# EasyEDA Pro project ProProject_Strain Gauge Paddle_2023-12-18.epro, schematic Strain Gauge Paddle

## Sheets
1 ESP and Power: Create Date: 2023-10-30; Page Name: ESP and Power; Project Name: Strain Gauge Paddle; Schematic Name: Strain Gauge Paddle; Update Date: 2023-11-11; Company: EasyEDA.com; Drawed: EasyEDA Pro; Page Size: A4; Part Number: JLCPCB-002; Reviewed: EasyEDA Pro; Version: V0.1
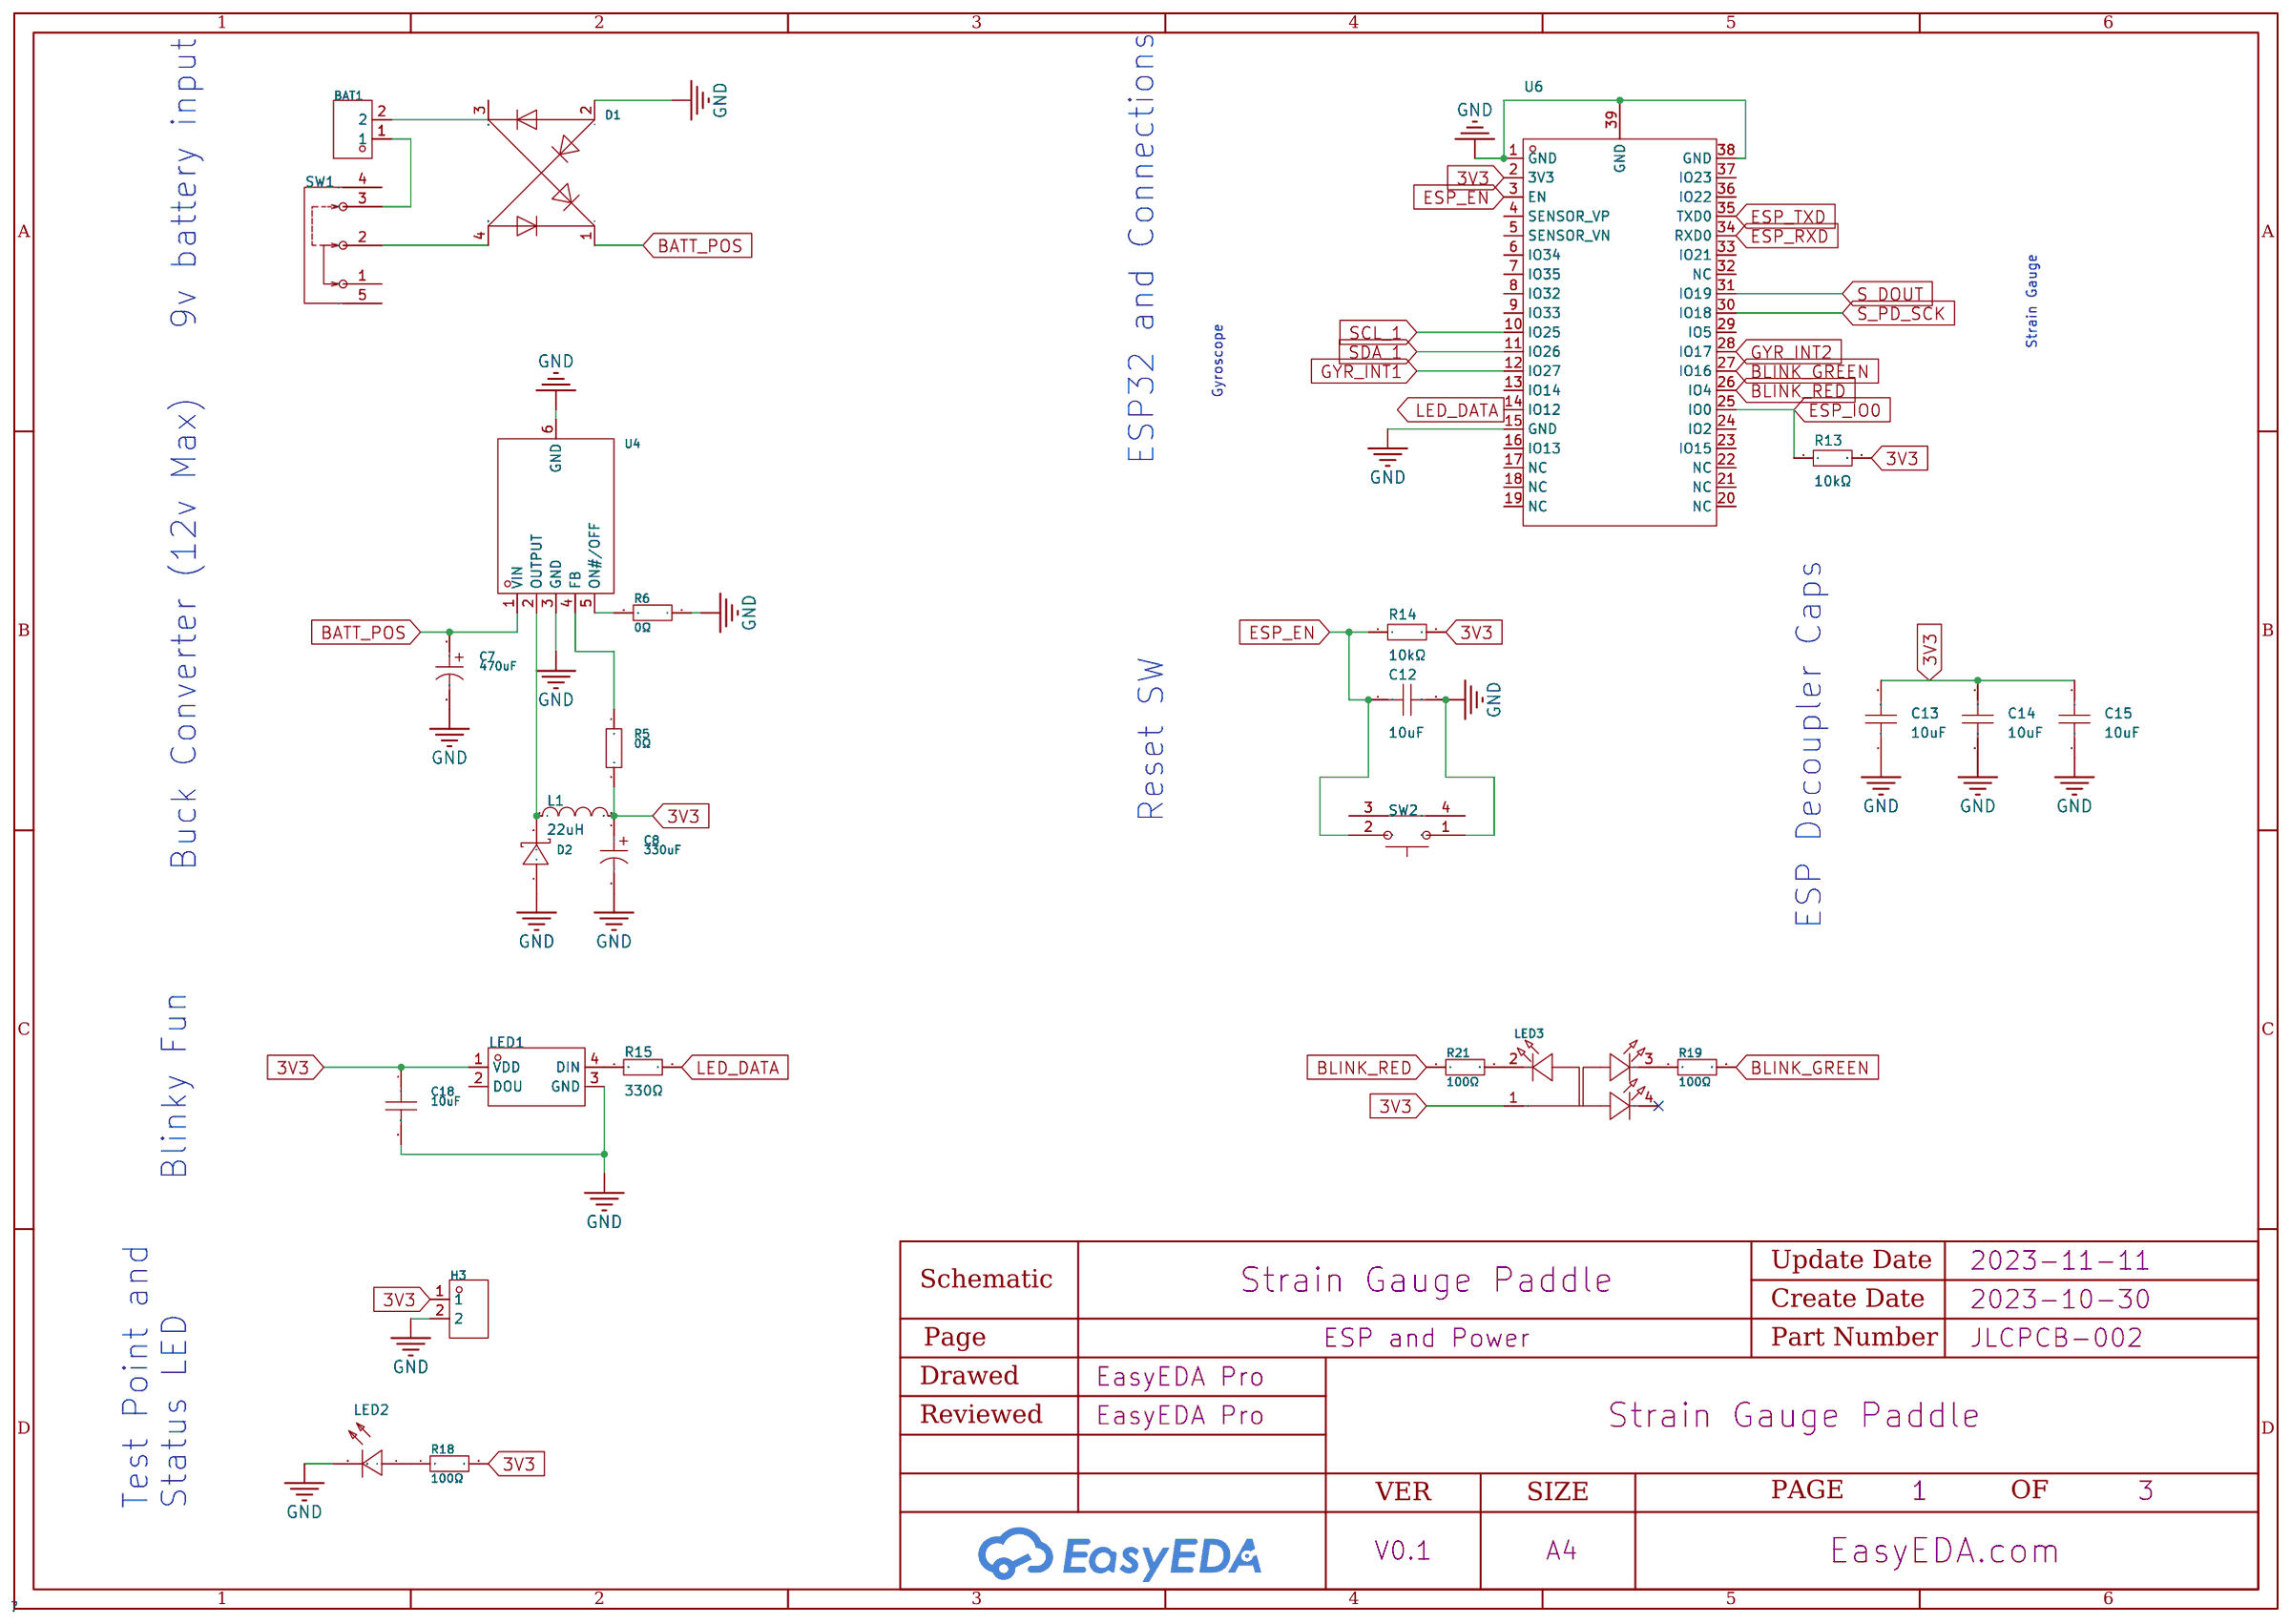
[diagram p0: ESP and Power]
2 Gyroscope and Strain Guage: Page Name: Gyroscope and Strain Guage; Update Date: 2023-12-15; Version: V0.2
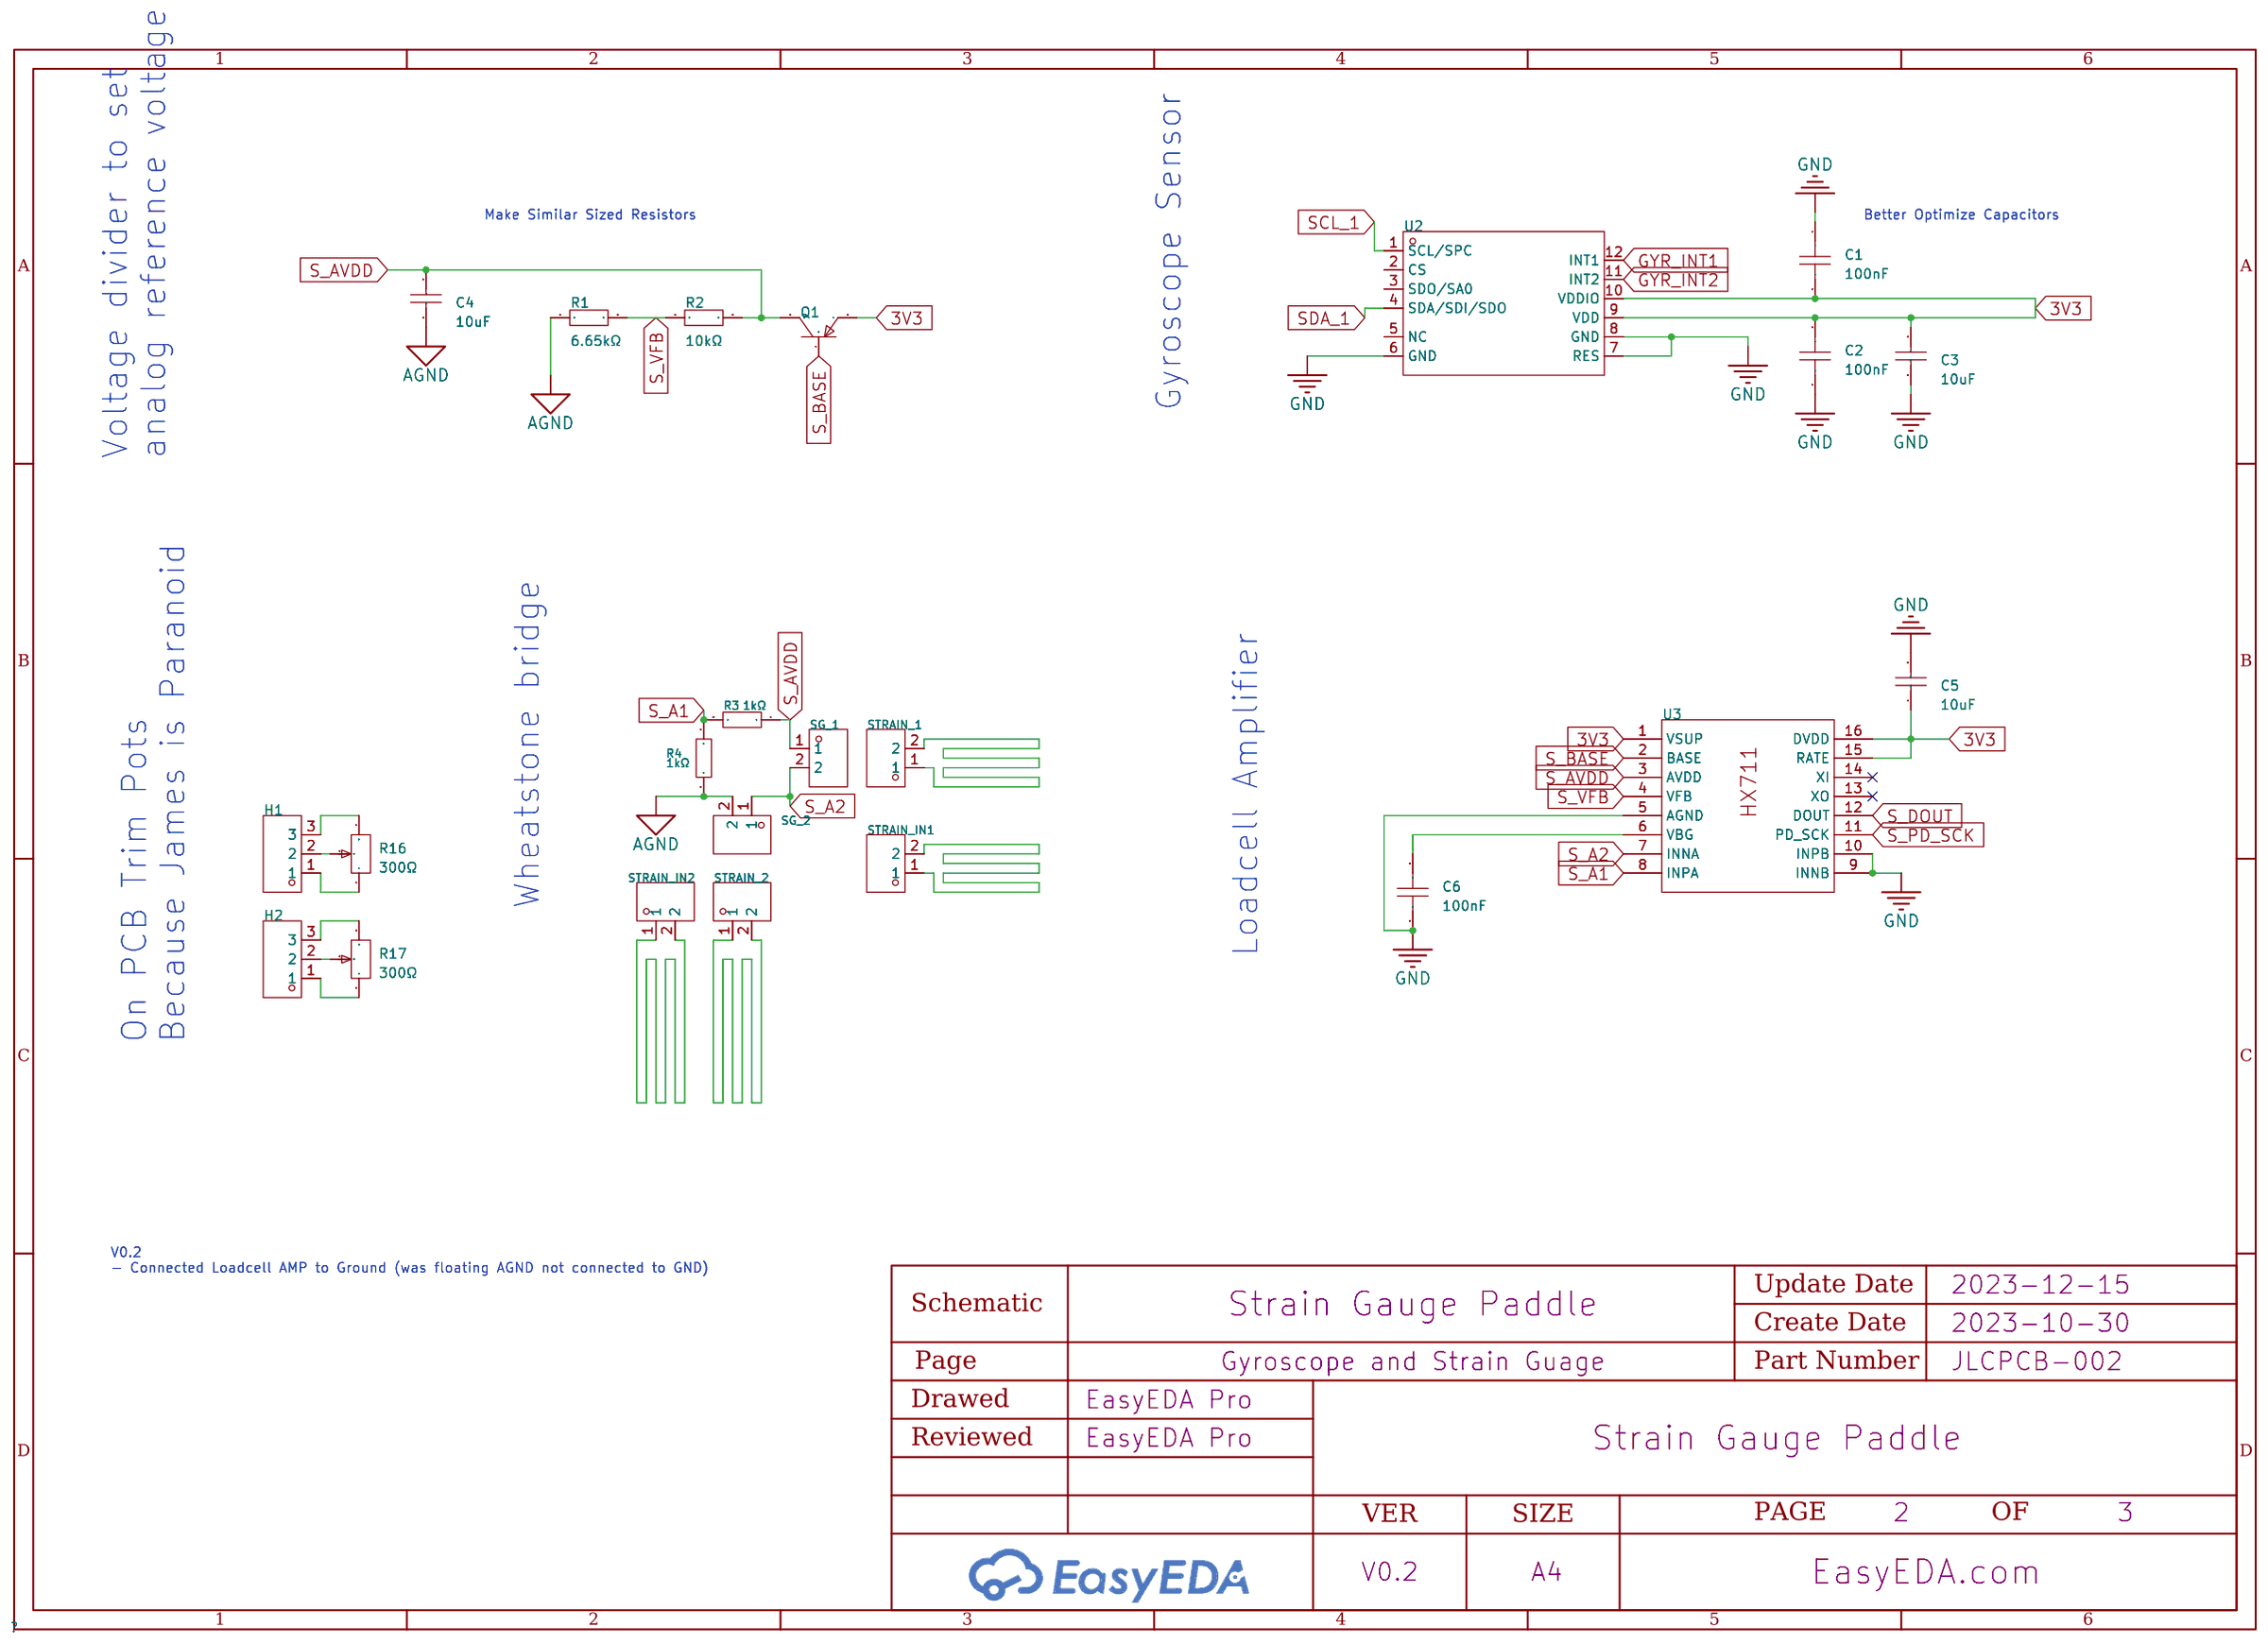
[diagram p1: Gyroscope and Strain Guage]
3 Serial: Create Date: 2023-11-12; Page Name: P3
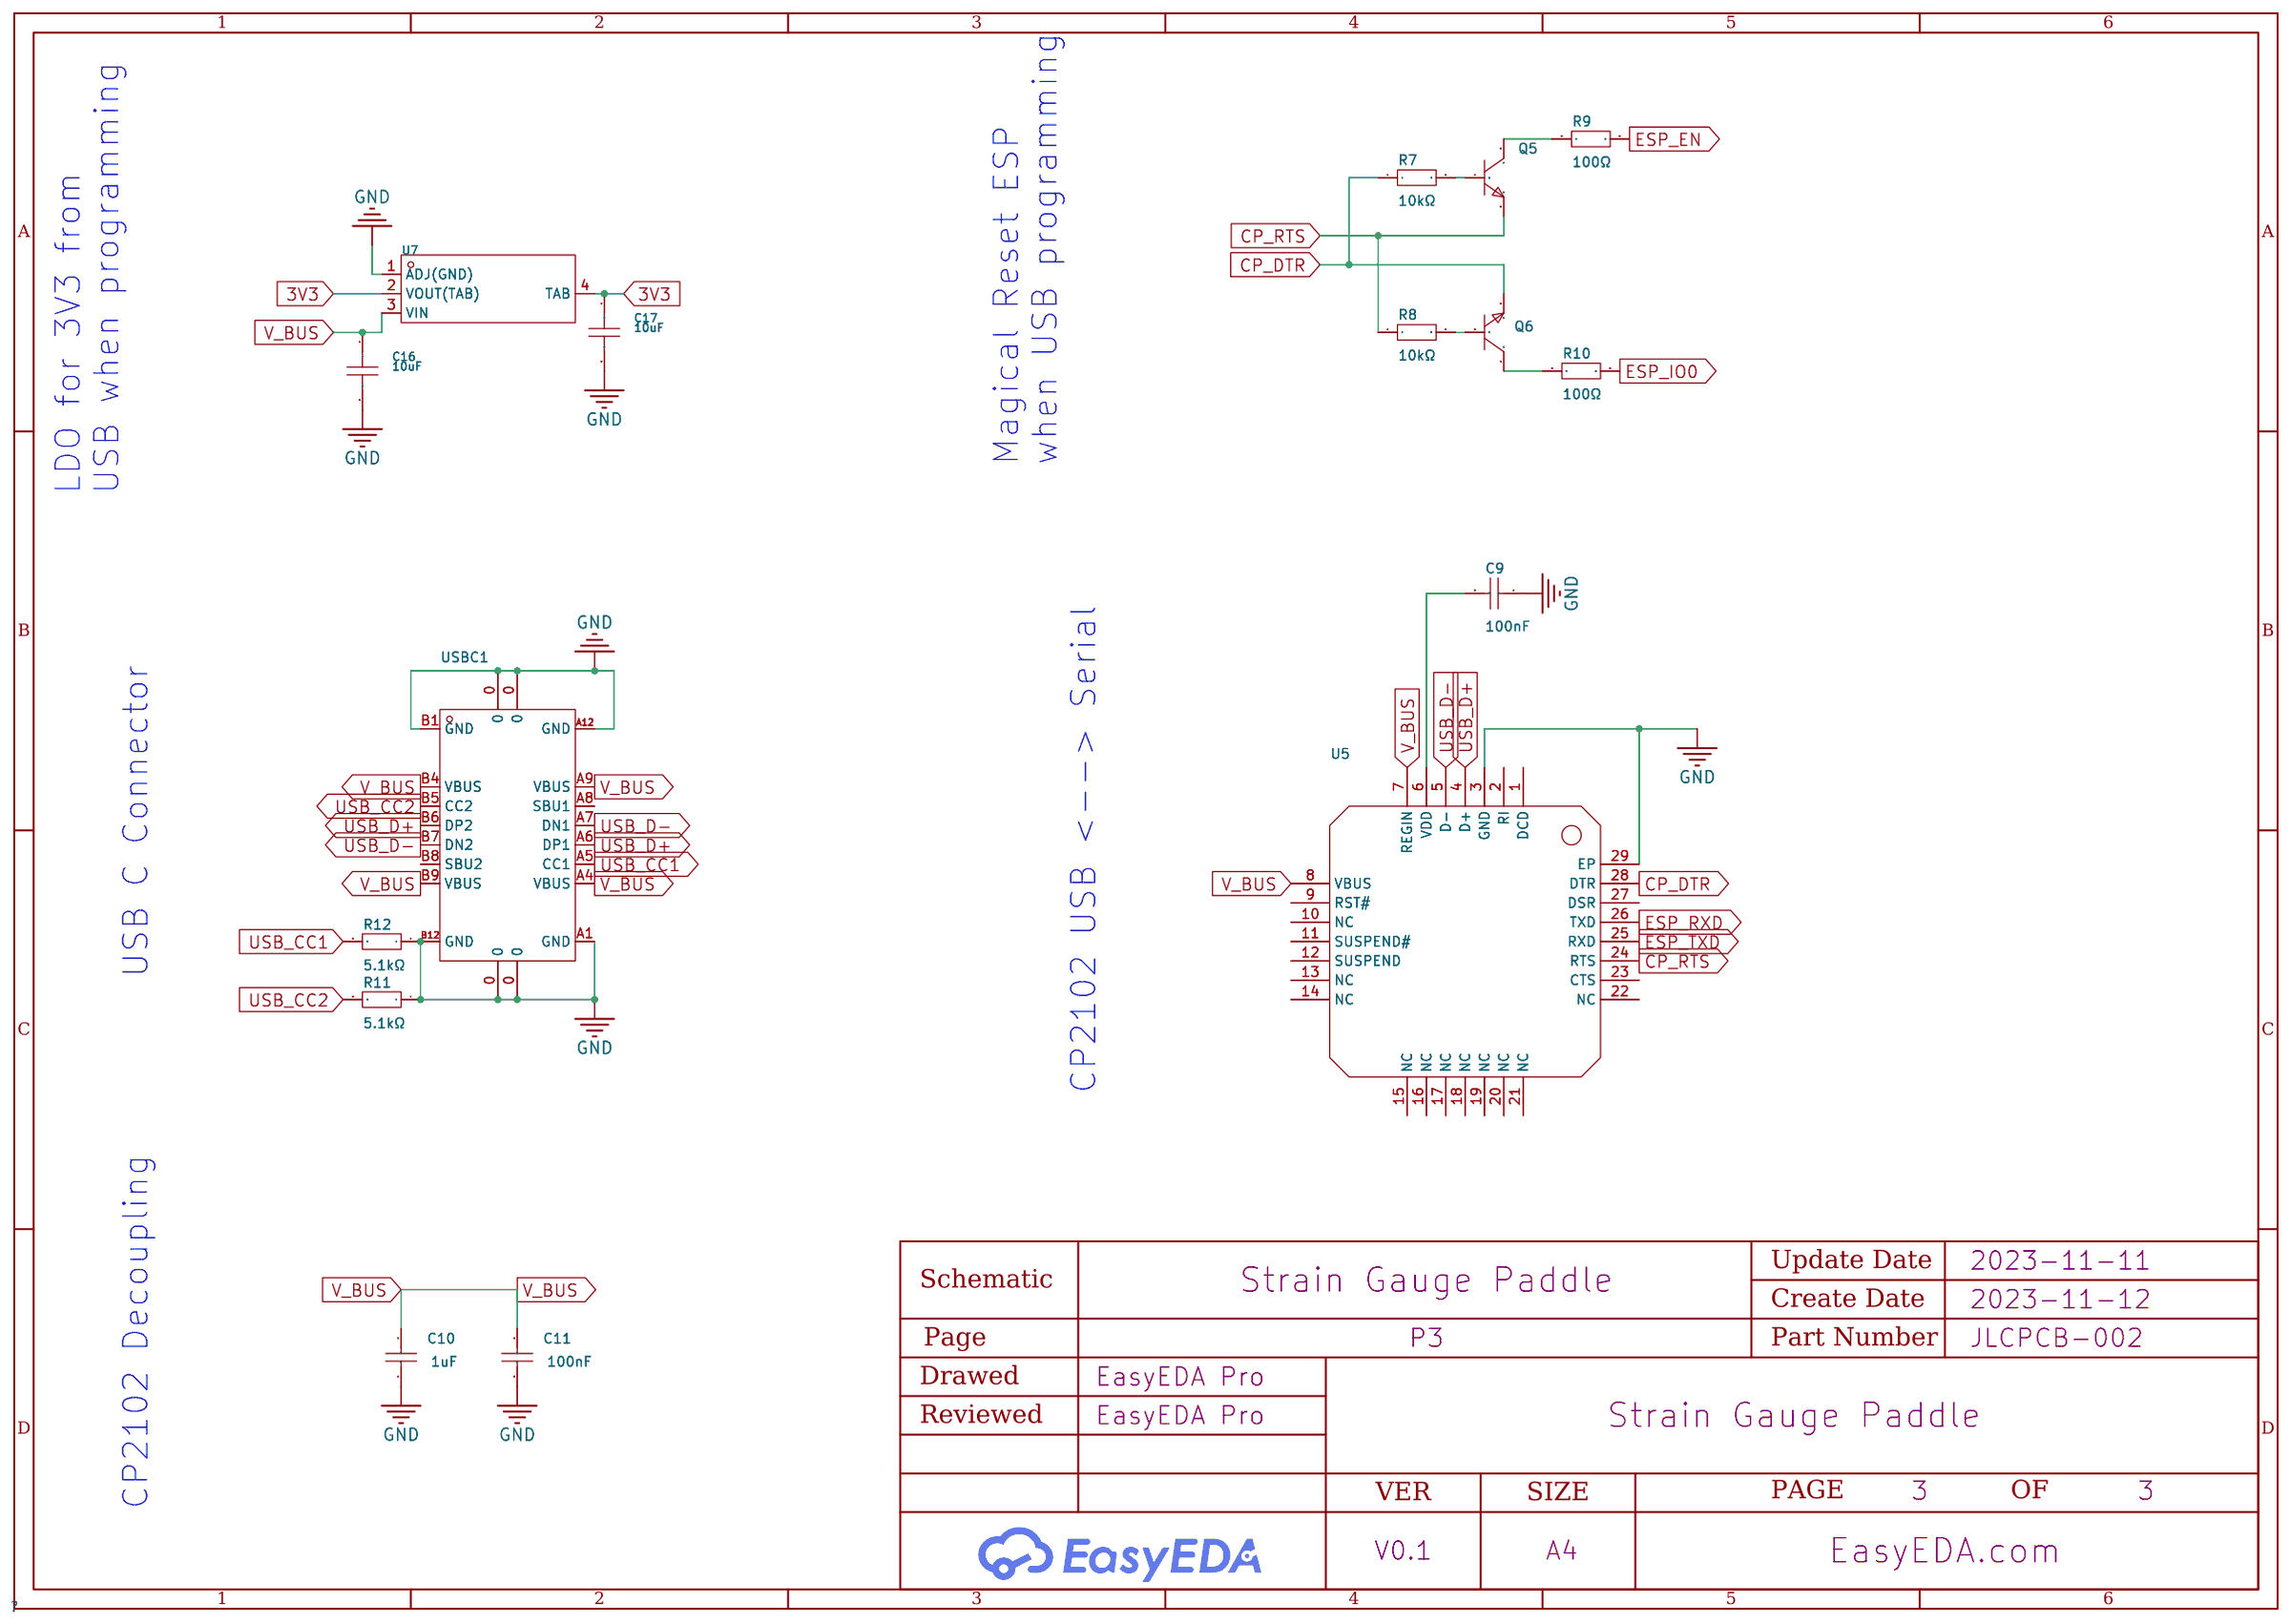
[diagram p2: Serial]

## Parts
sheet ESP and Power
BAT1  PZ254V-11-02P  [HDR-TH_2P-P2.54-V-M]  (no BOM)
C7  470uF  [CAP-SMD_BD6.3-L6.6-W6.6-LS7.6-RD]
C8  330uF  [CAP-SMD_BD6.3-L6.6-W6.6-LS7.4-FD]
C12  10uF  [C0402]
C13  10uF  [C0402]
C14  10uF  [C0402]
C15  10uF  [C0402]
C18  10uF  [C0603]
D1  MB10S  [MBS_L4.7-W3.8-P2.40-LS7.0-TL]
D2  SS54  [SMA_L4.4-W2.8-LS5.4-R-RD]
H3  PZ254V-11-02P  [HDR-TH_2P-P2.54-V-M]  (no BOM)
L1  22uH  [IND-SMD_L6.0-W6.0_SWPA6045S]
LED1  XL-5050RGBC-WS2812B  [LED-SMD_4P-L5.0-W5.0-BL_XL-5050RGBC]
LED2  BL-HJC36G-AV-TRB  [LED0603-R-RD_AMBER]
LED3  NH-B1010RGBT-HF  [LED-ARRAY-SMD_4P-L1.0-W1.0-TR_NH-B1010RGBT]
R5  0Ω  [R0805]
R6  0Ω  [R0805]
R13  10kΩ  [R0402]
R14  10kΩ  [R0402]
R15  330Ω  [R0603]
R18  100Ω  [R0603]
R19  100Ω  [R0603]
R21  100Ω  [R0603]
SW1  SK12D07VG4  [SW-TH_SK12D07VG4]
SW2  1TS003B-1400-3500A-CT  [KEY-SMD_1TS003B]
U4  LM2575S-3.3  [TO-263-5_L10.0-W8.4-P1.70-LS15.3-BR]
U6  -  [WIFI-SMD_ESP32-WROOM-32E]
sheet Gyroscope and Strain Guage
C1  100nF  [C0603]
C2  100nF  [C0603]
C3  10uF  [C0805]
C4  10uF  [C0805]
C5  10uF  [C0805]
C6  100nF  [C0603]
H1  PZ254V-11-03P  [HDR-TH_3P-P2.54-V-M]  (no BOM)
H2  PZ254V-11-03P  [HDR-TH_3P-P2.54-V-M]  (no BOM)
Q1  S8550  [SOT-23-3_L2.9-W1.3-P1.90-LS2.4-BR]
R1  6.65kΩ  [R0603]
R2  10kΩ  [R0805]
R3  1kΩ  [R0603]
R4  1kΩ  [R0603]
R16  300Ω  [RES-ADJ-SMD_VG039NCH]
R17  300Ω  [RES-ADJ-SMD_VG039NCH]
SG_1  PZ254V-11-02P  [HDR-TH_2P-P2.54-V-M]  (no BOM)
SG_2  PZ254V-11-02P  [HDR-TH_2P-P2.54-V-M]  (no BOM)
STRAIN_1  PZ254V-11-02P  [HDR-TH_2P-P2.54-V-M]  (no BOM)
STRAIN_2  PZ254V-11-02P  [HDR-TH_2P-P2.54-V-M]  (no BOM)
STRAIN_IN1  PZ254V-11-02P  [HDR-TH_2P-P2.54-V-M]  (no BOM)
STRAIN_IN2  PZ254V-11-02P  [HDR-TH_2P-P2.54-V-M]  (no BOM)
U2  LIS2DW12TR  [LGA-12_L2.0-W2.0-P0.50-BL]
U3  HX711  [SOP-16_L10.0-W3.9-P1.27-LS6.0-BL]
sheet Serial
C9  100nF  [C0402]
C10  1uF  [C0402]
C11  100nF  [C0402]
C16  10uF  [C0603]
C17  10uF  [C0603]
Q5  -  [SOT-23-3_L2.9-W1.3-P1.90-LS2.4-BR]
Q6  -  [SOT-23-3_L2.9-W1.3-P1.90-LS2.4-BR]
R7  10kΩ  [R0402]
R8  10kΩ  [R0402]
R9  100Ω  [R0402]
R10  100Ω  [R0402]
R11  5.1kΩ  [R0402]
R12  5.1kΩ  [R0402]
U5  -  [WQFN-28_L5.0-W5.0-P0.50-BL-EP3.2]
U7  AMS1117-3.3  [SOT-223-4_L6.5-W3.5-P2.30-LS7.0-BR]
USBC1  -  [USB-C_SMD-TYPE-C-31-M-12]

## Library data of the parts
BAT1 H3 SG_1 SG_2 STRAIN_1 STRAIN_2 STRAIN_IN1 STRAIN_IN2 = PZ254V-11-02P: Number of Rows:Plugin Number of Pins:2P Pitch:2.54mm Pin Structure:1x2P Row Spacing:- Mounting Type:Straight Circluar Pins/Square Pins:Square Pins Current Rating (Max):- Voltage Rating (Max):- Length of Mating Pin:6mm Insulation Height:2.5mm Length of End; LCSC Part Name: 2.54mm 1x2P 直插 方针; Supplier Part: C492401; Manufacturer: XFCN(兴飞); Supplier Footprint: 插件,P=2.54mm; JLCPCB Part Class: Extended Part; Datasheet: https://atta.szlcsc.com/upload/public/pdf/source/20200309/C492401_A812433581A9B211A7FFA413ADDFF0E5.pdf; Supplier: LCSC; Number of Rows: Plugin; Number of Pins: 2P; Pitch: 2.54mm; Pin Structure: 1x2P; Mounting Type: Straight; Circluar Pins/Square Pins: Square Pins; Length of Mating Pin: 6mm; Insulation Height: 2.5mm; Length of End Connection Pin: 3mm; Operating Temperature Range: -40℃~+105℃; Color: Black
C7 = RVT1C471M0607: Capacitance: Tolerance:±20% Tolerance:±20% Rated Voltage: φD: L: Lifetime @ Temp:2000hrs@105℃ Operating Temperature:-55℃~+105℃ Operating Temperature:-55℃~+105℃; LCSC Part Name: 470uF ±20% 16V; Supplier Part: C2977552; Manufacturer: ROQANG(容强); Supplier Footprint: SMD,6.3x7.7mm; JLCPCB Part Class: Extended Part; Supplier: LCSC; Tolerance: ±20%; Lifetime @ Temp: 2000hrs@105℃; Operating Temperature: -55℃~+105℃
C8 = RVT0J331M0605: Capacitance: Tolerance:±20% Tolerance:±20% Rated Voltage: φD: L: Ripple Current:95mA@120Hz Lifetime @ Temp:2000hrs@105℃ Operating Temperature:-40℃~+105℃ Operating Temperature:-40℃~+105℃; LCSC Part Name: 330uF ±20% 6.3V; Supplier Part: C2999060; Manufacturer: ROQANG(容强); Supplier Footprint: SMD,D6.3xL5.4mm; JLCPCB Part Class: Extended Part; Datasheet: https://atta.szlcsc.com/upload/public/pdf/source/20170325/1490427950282.pdf; Supplier: LCSC; Tolerance: ±20%; Ripple Current: 95mA@120Hz; Lifetime @ Temp: 2000hrs@105℃; Operating Temperature: -40℃~+105℃
C12-C15 = GRM155R61A106ME44D: Capacitance:10uF Tolerance:±20% Tolerance:±20% Voltage Rated:10V Temperature Coefficient:X5R; LCSC Part Name: 10uF ±20% 10V; Supplier Part: C77000; Manufacturer: muRata(村田); Supplier Footprint: 0402; JLCPCB Part Class: Extended Part; Datasheet: https://atta.szlcsc.com/upload/public/pdf/source/20180530/C77000_4866797CFE3A842CD03C597EBD6AE6CD.pdf; Supplier: LCSC; Tolerance: ±20%; Voltage Rated: 10V; Temperature Coefficient: X5R
C16-C18 = CL10A106MQ8NNNC: Capacitance: Tolerance:±20% Tolerance:±20% Voltage Rated: Temperature Coefficient:; LCSC Part Name: 10uF ±20% 6.3V; Supplier Part: C1691; Manufacturer: SAMSUNG(三星); Supplier Footprint: 0603; JLCPCB Part Class: Extended Part; Datasheet: https://atta.szlcsc.com/upload/public/pdf/source/20160218/1457707763339.pdf; Supplier: LCSC; Tolerance: ±20%
D1 = MB10S_C2488: Reverse Voltage (Vr): Average Rectified Current (Io): Forward Voltage (Vf@If):1.1V@400mA Reverse Leakage Current (Ir):5uA@1kV Peak Forward Surge Current: Operating Temperature:-55℃~+150℃@(Tj) Operating Temperature:-55℃~+150℃@(Tj); LCSC Part Name: 电压:1kV 电流:1A 大芯片  .; Supplier Part: C2488; Manufacturer: MDD; Supplier Footprint: MBS; JLCPCB Part Class: Basic Part; Datasheet: https://atta.szlcsc.com/upload/public/pdf/source/20210506/C2487_3177A890C810790094D6606D0B30B249.pdf; Supplier: LCSC; Forward Voltage (Vf@If): 1.1V@400mA; Reverse Leakage Current (Ir): 5uA@1kV; Operating Temperature: -55℃~+150℃@(Tj)
D2 = SS54_C22452: Supplier Part: C22452; Manufacturer: MDD; Supplier Footprint: SMA(DO-214AC); JLCPCB Part Class: Basic Part; Supplier: LCSC
L1 = SWPA6045S220MT: Inductance: Tolerance: Tolerance: Rated Current: DC Resistance (DCR):; LCSC Part Name: 22uH ±20% 1.8A 89mΩ; Supplier Part: C83454; Manufacturer: Sunlord(顺络); Supplier Footprint: SMD; JLCPCB Part Class: Extended Part; Datasheet: https://atta.szlcsc.com/upload/public/pdf/source/20210916/AC798BA7E846B7D0B6818F45CD84DB0B.pdf; Supplier: LCSC
LED1 = XL-5050RGBC-WS2812B: Emitted Color:RGB Diode Configuration:- Lens Color:Colorless transparence Dominant Wavelength:- Dominant Wavelength:- Peak Wavelength:625nm；470nm；530nm Color Temperature:- Color Temperature:- Forward Current:- Power Dissipation:- Viewing Angle:120° Mounti; LCSC Part Name: RGB三色 正贴 幻彩; Supplier Part: C2843785; Manufacturer: XINGLIGHT(成兴光); Supplier Footprint: SMD5050; JLCPCB Part Class: Extended Part; Datasheet: https://atta.szlcsc.com/upload/public/pdf/source/20230111/86AAD2096485A2E5BCAB883FF8CBE6FD.pdf; Supplier: LCSC; Emitted Color: RGB; Lens Color: Colorless transparence; Peak Wavelength: 625nm；470nm；530nm; Viewing Angle: 120°; Mounting Sytle: Positive post; Operating Temperature: -30℃~+70℃
LED2 = BL-HJC36G-AV-TRB: Emitted Color:琥珀 Diode Configuration:- Lens Color:Colorless transparence Dominant Wavelength:600nm~610nm Dominant Wavelength:600nm~610nm Peak Wavelength:610nm Color Temperature:- Color Temperature:- Forward Current:20mA Power Dissipation:50mW Viewing Angl; LCSC Part Name: 琥珀; Supplier Part: C165983; Manufacturer: BrtLed(佰鸿); Supplier Footprint: 0603; JLCPCB Part Class: Extended Part; Datasheet: https://atta.szlcsc.com/upload/public/pdf/source/20180423/C165983_15824C4AC102B53D51061E9D029254F9.pdf; Supplier: LCSC; Emitted Color: 琥珀; Lens Color: Colorless transparence; Dominant Wavelength: 600nm~610nm; Peak Wavelength: 610nm; Forward Current: 20mA; Power Dissipation: 50mW; Viewing Angle: 120°; Operating Temperature: -40℃~+85℃
LED3 = NH-B1010RGBT-HF: Emitted Color:RGB Diode Configuration:Common anode Lens Color:- Dominant Wavelength:470nm；620nm；530nm Dominant Wavelength:470nm；620nm；530nm Peak Wavelength:- Color Temperature:- Color Temperature:- Forward Current:2mA；5mA Power Dissipation:24mW；32mW Viewi; LCSC Part Name: RGB三色 1010RGB; Supplier Part: C2874113; Manufacturer: 国星光电; Supplier Footprint: 0404; JLCPCB Part Class: Extended Part; Datasheet: https://atta.szlcsc.com/upload/public/pdf/source/20210810/0B2E174735C36A18A5A2783CB3D0373F.pdf; Supplier: LCSC; Emitted Color: RGB; Diode Configuration: Common anode; Dominant Wavelength: 470nm；620nm；530nm; Forward Current: 2mA；5mA; Power Dissipation: 24mW；32mW; Viewing Angle: 120°; Operating Temperature: -30℃~+85℃
R5 R6 = 0805W8F0000T5E_C17477: Type:Thick Film Resistors Resistance: Tolerance:±1% Tolerance:±1% Power(Watts): Temperature Coefficient:±800ppm/℃ Temperature Coefficient:±800ppm/℃ Overload Voltage (Max): Operating Temperature Range:-55℃~+155℃ Operating Temperature Range:-55℃~+155℃; LCSC Part Name: 厚膜电阻 0Ω ±1% 125mW; Supplier Part: C17477; Manufacturer: UNI-ROYAL(厚声); Manufacturer Part: 0805W8F0000T5E; Supplier Footprint: 0805; JLCPCB Part Class: Basic Part; Datasheet: https://atta.szlcsc.com/upload/public/pdf/source/20200306/C422600_1E6D84923E4A46A82E41ADD87F860B5C.pdf; Supplier: LCSC; Type: Thick Film Resistors; Tolerance: ±1%; Temperature Coefficient: ±800ppm/℃; Operating Temperature Range: -55℃~+155℃
R7 R8 R13 R14 = WR04X1002FTL: Resistance:10kΩ Tolerance:±1% Tolerance:±1% Power(Watts):1/16W Temperature Coefficient:±100ppm/ Temperature Coefficient:±100ppm/ Overload Voltage (Max):50V Operating Temperature Range:-55~+155 Operating Temperature Range:-55~+155; LCSC Part Name: 10kΩ ±1% 1/16W; Supplier Part: C163810; Manufacturer: 华新科(Walsin); Supplier Footprint: 0402; JLCPCB Part Class: Extended Part; Datasheet: https://atta.szlcsc.com/upload/public/pdf/source/20180228/C163810_15198053310761377184.pdf; Supplier: LCSC; Tolerance: ±1%; Power(Watts): 1/16W; Temperature Coefficient: ±100ppm/; Overload Voltage (Max): 50V; Operating Temperature Range: -55~+155
R15 = 0603WAF3300T5E: Type:Thick Film Resistors Resistance: Tolerance:±1% Tolerance:±1% Power(Watts): Temperature Coefficient:±100ppm/℃ Temperature Coefficient:±100ppm/℃ Overload Voltage (Max): Operating Temperature Range:-55℃~+155℃ Operating Temperature Range:-55℃~+155℃; LCSC Part Name: 330Ω ±1% 100mW; Supplier Part: C23138; Manufacturer: UNI-ROYAL(厚声); Supplier Footprint: 0603; JLCPCB Part Class: Basic Part; Datasheet: https://atta.szlcsc.com/upload/public/pdf/source/20200306/C422600_1E6D84923E4A46A82E41ADD87F860B5C.pdf; Supplier: LCSC; Type: Thick Film Resistors; Tolerance: ±1%; Temperature Coefficient: ±100ppm/℃; Operating Temperature Range: -55℃~+155℃
R18 R19 R21 = 0603WAF1000T5E: Type:Thick Film Resistors Resistance: Tolerance:±1% Tolerance:±1% Power(Watts): Temperature Coefficient:±200ppm/℃ Temperature Coefficient:±200ppm/℃ Overload Voltage (Max): Operating Temperature Range:-55℃~+155℃ Operating Temperature Range:-55℃~+155℃; LCSC Part Name: 厚膜电阻 100Ω ±1% 100mW; Supplier Part: C22775; Manufacturer: UNI-ROYAL(厚声); Supplier Footprint: 0603; JLCPCB Part Class: Basic Part; Datasheet: https://atta.szlcsc.com/upload/public/pdf/source/20200306/C422600_1E6D84923E4A46A82E41ADD87F860B5C.pdf; Supplier: LCSC; Type: Thick Film Resistors; Tolerance: ±1%; Temperature Coefficient: ±200ppm/℃; Operating Temperature Range: -55℃~+155℃
SW1 = SK12D07VG4: Operating Force: Contact Material: Rated Voltage(DC): Contact Rating @ Voltage: Contact Finish:- Operating Temperature: Circuit: Electrical Life Cycles: Rated Voltage(AC):- Mounting Type: Switch Function: Switch Height: Actuator Orientation:Horizontal Con; LCSC Part Name: 3脚2二档位SK12D07VG4滑动开关1P2T卧式拨动开关; Supplier Part: C393937; Manufacturer: SHOU HAN(首韩); Supplier Footprint: 插件,P=2mm; JLCPCB Part Class: Extended Part; Supplier: LCSC; Actuator Orientation: Horizontal
SW2 = 1TS003B-1400-3500A-CT: Contact Current:50mA Voltage Rating (DC):12V Power Rating:0.6W Insulation Resistance:100MΩ Circuit:SPST Mounting Style:Surface Mount Actuator Style:Rectangle button Actuator/Cap Color:Black With Lamp:No Operating Force:140gf@±30gf Mechanical Life:50000次 O; LCSC Part Name: 4.6*1.82*3.5mm 卧贴 轻触开关; Supplier Part: C319392; Manufacturer: HYP(鸿源精密); Supplier Footprint: SMD,1.8x4.6mm; JLCPCB Part Class: Extended Part; Datasheet: https://atta.szlcsc.com/upload/public/pdf/source/20181106/C319392_EA06B27D310AC8B4E1BA9275A0C91ACF.pdf; Supplier: LCSC; Contact Current: 50mA; Voltage Rating (DC): 12V; Power Rating: 0.6W; Insulation Resistance: 100MΩ; Circuit: SPST; Mounting Style: Surface Mount; Actuator Style: Rectangle button; Actuator/Cap Color: Black; With Lamp: No; Operating Force: 140gf@±30gf; Mechanical Life: 50000次; Operating Temperature: -40℃~+90℃; Pin Style: J pin; Switch Length: 4.6mm; Switch Width: 1.82mm; Switch Height: 3.5mm; Strike Gundam: NO
U4 = LM2575S-3.3: Function:Step-down type Synchronous Rectification:NO Output Type:Fixed Number of Outputs:1 Topology:Step-down Input Voltage:40V Input Voltage:40V Output Voltage:3.3V Output Voltage:3.3V Output Current (Max):2A Switching Frequency:150kHz Operating Temperat; Supplier Part: C347404; Manufacturer: UMW(友台半导体); Supplier Footprint: TO-263-5; JLCPCB Part Class: Extended Part; Datasheet: https://atta.szlcsc.com/upload/public/pdf/source/20221111/31B0C20E558954BB4B875F26A62E318D.pdf; Supplier: LCSC; Function: Step-down type; Synchronous Rectification: NO; Output Type: Fixed; Number of Outputs: 1; Topology: Step-down; Input Voltage: 40V; Output Voltage: 3.3V; Output Current (Max): 2A; Switching Frequency: 150kHz; Operating Temperature: -40℃~+125℃@(TJ)
U6 = ESP32-WROOM-32E(8MB): LCSC Part Name: WIFI模块 PCB板载天线模组; Supplier Part: C701342; Manufacturer: ESPRESSIF 乐鑫; Supplier Footprint: SMD38,18x25.5x3.1; JLCPCB Part Class: Extended Part; Datasheet: https://atta.szlcsc.com/upload/public/pdf/source/20200730/C701341_95E089979D39CD8D2471FDC7C7AF29A1.pdf; Supplier: LCSC
C1 C2 C6 = CC0603KRX7R9BB104: Capacitance: Tolerance:±10% Tolerance:±10% Voltage Rated: Temperature Coefficient:; LCSC Part Name: 100nF ±10% 50V; Supplier Part: C14663; Manufacturer: YAGEO(国巨); Supplier Footprint: 0603; JLCPCB Part Class: Basic Part; Datasheet: https://atta.szlcsc.com/upload/public/pdf/source/20180910/C282072_33301C7F631E79921B82A8DAC6BCC5B3.pdf; Supplier: LCSC; Tolerance: ±10%
C3-C5 = CL21A106KAYNNNE_C15850: Capacitance: Tolerance:±10% Tolerance:±10% Voltage Rated: Temperature Coefficient:; LCSC Part Name: 10uF ±10% 25V; Supplier Part: C15850; Manufacturer: SAMSUNG(三星); Manufacturer Part: CL21A106KAYNNNE; Supplier Footprint: 0805; JLCPCB Part Class: Basic Part; Datasheet: https://atta.szlcsc.com/upload/public/pdf/source/20160103/1457707679302.pdf; Supplier: LCSC; Tolerance: ±10%
H1 H2 = PZ254V-11-03P: Number of Rows:单排 Number of Pins:3 Pitch:2.54mm Pin Structure:1x3P Row Spacing:- Mounting Type:Straight Circluar Pins/Square Pins:Square Pins Current Rating (Max):3A Voltage Rating (Max):250V Length of Mating Pin:6mm Insulation Height:2.5mm Length of End; LCSC Part Name: 2.54mm 1x3P 直插 方针; Supplier Part: C2937625; Manufacturer: XFCN(兴飞); Supplier Footprint: 直插,P=2.54mm; JLCPCB Part Class: Extended Part; Datasheet: 2022-07-12/581362A/62b9d00620994b3696be7eb4af85ad72/双排排针和单排排针.pdf; Supplier: LCSC; Number of Rows: 单排; Number of Pins: 3; Pitch: 2.54mm; Pin Structure: 1x3P; Mounting Type: Straight; Circluar Pins/Square Pins: Square Pins; Current Rating (Max): 3A; Voltage Rating (Max): 250V; Length of Mating Pin: 6mm; Insulation Height: 2.5mm; Length of End Connection Pin: 3mm; Operating Temperature Range: -40℃~+105℃; Color: Black
Q1 = S8550_C2891805: Supplier Part: C2891805; Manufacturer: YONGYUTAI(永裕泰); Supplier Footprint: SOT-23; JLCPCB Part Class: Extended Part; Datasheet: https://atta.szlcsc.com/upload/public/pdf/source/20210901/65C3C4D1695A9271DEFEFE0B623CB3B1.pdf; Supplier: LCSC
R1 = 0603WAF6651T5E: Type:Thick Film Resistors Resistance: Tolerance:±1% Tolerance:±1% Power(Watts): Temperature Coefficient:±100ppm/℃ Temperature Coefficient:±100ppm/℃ Overload Voltage (Max): Operating Temperature Range:-55℃~+155℃ Operating Temperature Range:-55℃~+155℃; LCSC Part Name: 6.65kΩ ±1% 100mW; Supplier Part: C60344; Manufacturer: UNI-ROYAL(厚声); Supplier Footprint: 0603; JLCPCB Part Class: Extended Part; Datasheet: https://atta.szlcsc.com/upload/public/pdf/source/20200306/C422600_1E6D84923E4A46A82E41ADD87F860B5C.pdf; Supplier: LCSC; Type: Thick Film Resistors; Tolerance: ±1%; Temperature Coefficient: ±100ppm/℃; Operating Temperature Range: -55℃~+155℃
R2 = 0805W8F1002T5E: Type:Thick Film Resistors Resistance: Tolerance:±1% Tolerance:±1% Power(Watts): Temperature Coefficient:±100ppm/℃ Temperature Coefficient:±100ppm/℃ Overload Voltage (Max): Operating Temperature Range:-55℃~+155℃ Operating Temperature Range:-55℃~+155℃; LCSC Part Name: 10kΩ ±1% 125mW; Supplier Part: C17414; Manufacturer: UNI-ROYAL(厚声); Supplier Footprint: 0805; JLCPCB Part Class: Basic Part; Datasheet: https://atta.szlcsc.com/upload/public/pdf/source/20200306/C422600_1E6D84923E4A46A82E41ADD87F860B5C.pdf; Supplier: LCSC; Type: Thick Film Resistors; Tolerance: ±1%; Temperature Coefficient: ±100ppm/℃; Operating Temperature Range: -55℃~+155℃
R3 R4 = 0603WAF1001T5E: Type:Thick Film Resistors Resistance: Tolerance:±1% Tolerance:±1% Power(Watts): Temperature Coefficient:±100ppm/℃ Temperature Coefficient:±100ppm/℃ Overload Voltage (Max): Operating Temperature Range:-55℃~+155℃ Operating Temperature Range:-55℃~+155℃; LCSC Part Name: 厚膜电阻 1kΩ ±1% 100mW; Supplier Part: C21190; Manufacturer: UNI-ROYAL(厚声); Supplier Footprint: 0603; JLCPCB Part Class: Basic Part; Datasheet: https://atta.szlcsc.com/upload/public/pdf/source/20200306/C422600_1E6D84923E4A46A82E41ADD87F860B5C.pdf; Supplier: LCSC; Type: Thick Film Resistors; Tolerance: ±1%; Temperature Coefficient: ±100ppm/℃; Operating Temperature Range: -55℃~+155℃
R16 R17 = VG039NCHXTB301: Resistance: Tolerance:±25% Tolerance:±25%; LCSC Part Name: 300Ω ±25%; Supplier Part: C128553; Manufacturer: HDK(北陆电气); Supplier Footprint: SMD; JLCPCB Part Class: Extended Part; Datasheet: https://atta.szlcsc.com/upload/public/pdf/source/20170824/C128553_1503566144292907493.pdf; Supplier: LCSC; Tolerance: ±25%
U2 = LIS2DW12TR: Supplier Part: C189624; Manufacturer: ST(意法半导体); Supplier Footprint: LGA-12; JLCPCB Part Class: Extended Part; Datasheet: https://atta.szlcsc.com/upload/public/pdf/source/20180403/C189624_150963097ED842400E055DE40577DCB1.pdf; Supplier: LCSC
U3 = HX711: Supplier Part: C43656; Manufacturer: AVIA(海芯科技); Supplier Footprint: SOP-16; JLCPCB Part Class: Extended Part; Datasheet: https://atta.szlcsc.com/upload/public/pdf/source/20201105/C43656_14FD91CAE53E7DB415D03EABCB162D83.pdf; Supplier: LCSC
C9 C11 = 0402X104K250CT: Capacitance:100nF Tolerance:±10% Tolerance:±10% Voltage Rated:25V Temperature Coefficient:X5R; LCSC Part Name: 100nF ±10% 25V; Supplier Part: C237172; Manufacturer: 华新科(Walsin); Supplier Footprint: 0402; JLCPCB Part Class: Extended Part; Datasheet: https://atta.szlcsc.com/upload/public/pdf/source/20180806/C237172_13C8C970B0EC31A3E454807C4A5F32DE.pdf; Supplier: LCSC; Tolerance: ±10%; Voltage Rated: 25V; Temperature Coefficient: X5R
C10 = GRM155R61E105KA12D: Capacitance:1uF Tolerance:±10% Tolerance:±10% Voltage Rated:25V Temperature Coefficient:X5R; LCSC Part Name: 1uF ±10% 25V; Supplier Part: C77009; Manufacturer: muRata(村田); Supplier Footprint: 0402; JLCPCB Part Class: Extended Part; Datasheet: https://atta.szlcsc.com/upload/public/pdf/source/20180326/C77009_C84F63FC30571BAC77C5C818267378FE.pdf; Supplier: LCSC; Tolerance: ±10%; Voltage Rated: 25V; Temperature Coefficient: X5R
Q5 Q6 = BC817: Transistor Type:NPN Collector-Emitter Breakdown Voltage (Vceo):45V Collector Current (Ic):500mA Power Dissipation (Pd):300mW Collector-Emitter Saturation Voltage (VCE(sat)@Ic,Ib):700mV@500mA,50mA DC Current Gain (hFE@Ic,Vce):100@100mA,1V Transition Freque; LCSC Part Name: BC817-16; Supplier Part: C2137; Manufacturer: CJ（江苏长电/长晶）; Supplier Footprint: SOT-23(SOT-23-3); JLCPCB Part Class: Extended Part; Datasheet: https://atta.szlcsc.com/upload/public/pdf/source/20140809/1457707208989.pdf; Supplier: LCSC; Transistor Type: NPN; Collector-Emitter Breakdown Voltage (Vceo): 45V; Collector Current (Ic): 500mA; Power Dissipation (Pd): 300mW; Collector-Emitter Saturation Voltage (VCE(sat)@Ic,Ib): 700mV@500mA,50mA; DC Current Gain (hFE@Ic,Vce): 100@100mA,1V; Transition Frequency (fT): 100MHz; Operating Temperature: +150@(Tj)
R9 R10 = AECR0402F100RK9: Type:厚膜电阻 Resistance:100Ω Tolerance:±1% Power(Watts):63mW Temperature Coefficient:±100ppm/ Temperature Coefficient:±100ppm/ Overload Voltage (Max):50V Operating Temperature Range:-55~+125 Operating Temperature Range:-55~+125; LCSC Part Name: 100Ω ±1%; Supplier Part: C328297; Manufacturer: RESI(开步睿思）; Supplier Footprint: 0402; JLCPCB Part Class: Extended Part; Datasheet: https://atta.szlcsc.com/upload/public/pdf/source/20181108/C328297_22D2FD9B6826111D81BA2099DA41EA29.pdf; Supplier: LCSC; Type: 厚膜电阻; Tolerance: ±1%; Power(Watts): 63mW; Temperature Coefficient: ±100ppm/; Overload Voltage (Max): 50V; Operating Temperature Range: -55~+125
R11 R12 = ERJ2RKF5101X: Resistance:5.1kΩ Tolerance:±1% Power(Watts):1/10W Temperature Coefficient:±100ppm/ Temperature Coefficient:±100ppm/ Overload Voltage (Max):- Operating Temperature Range:-55~+155 Operating Temperature Range:-55~+155; LCSC Part Name: 5.1kΩ ±1%; Supplier Part: C278598; Manufacturer: PANASONIC(松下); Supplier Footprint: 0402; JLCPCB Part Class: Extended Part; Datasheet: https://atta.szlcsc.com/upload/public/pdf/source/20181114/C278598_63FD5E98FC43ADF35472DB19D0990B3C.pdf; Supplier: LCSC; Tolerance: ±1%; Power(Watts): 1/10W; Temperature Coefficient: ±100ppm/; Operating Temperature Range: -55~+155
U5 = CP2102-GMR: Type:Transceiver Protocol:USB Number of Drivers/Receivers:1/1 Data Rate:1Mbps Supply Voltage:3V ~ 3.6V; Supplier Part: C6568; Manufacturer: SILICON LABS(芯科); Supplier Footprint: QFN-28_5x5x05P; JLCPCB Part Class: Basic Part; Datasheet: https://atta.szlcsc.com/upload/public/pdf/source/20170103/1483439882795.pdf; Supplier: LCSC; Type: Transceiver; Protocol: USB; Number of Drivers/Receivers: 1/1; Data Rate: 1Mbps; Supply Voltage: 3V ~ 3.6V
U7 = AMS1117-3.3_C347222: Output Type: Output Polarity:Positive Number of Outputs:1 Maximum Input Voltage:18V Output Voltage:3.3V Output Voltage:3.3V Dropout Voltage:1.3V@(1A) Output Current:1A Power Supply Rejection Ratio (PSRR):60dB@(120Hz); LCSC Part Name: 输入18V 输出3.3V 1A; Supplier Part: C347222; Manufacturer: UMW(友台半导体); Supplier Footprint: SOT-223; JLCPCB Part Class: Extended Part; Datasheet: https://atta.szlcsc.com/upload/public/pdf/source/20211011/50CC665C22E3A66C08379A4A74BDA25C.pdf; Supplier: LCSC; Output Polarity: Positive; Number of Outputs: 1; Maximum Input Voltage: 18V; Output Voltage: 3.3V; Dropout Voltage: 1.3V@(1A); Output Current: 1A; Power Supply Rejection Ratio (PSRR): 60dB@(120Hz)
USBC1 = TYPE-C-31-M-12: Connector Type:Type-C Standard:- Gender:母座 Number of Contacts:16 Number of Ports:1 Current Rating - Power (Max):250mA; Supplier Part: C165948; Manufacturer: 韩国韩荣; JLCPCB Part Class: Extended Part; Datasheet: https://atta.szlcsc.com/upload/public/pdf/source/20210111/C2682493_D8CCFED08835E878D16ACCF4460E43B8.pdf; Supplier: LCSC; Connector Type: Type-C; Gender: 母座; Number of Contacts: 16; Number of Ports: 1; Current Rating - Power (Max): 250mA

## Nets
3V3: C1.2 C2.2 C3.2 C5.1 C8.1 C13.2 C14.2 C15.2 C17.1 C18.1 H3.1 L1.2 LED1.1(VDD) LED3.1(+) Q1.2(E) R5.2 R13.2 R14.2 R18.2 U2.9(VDD) U2.10(VDDIO) U3.1(VSUP) U3.15(RATE) U3.16(DVDD) U6.2(3V3) U7.2(VOUT(TAB)) U7.4(TAB)
AGND: C4.1 R1.1 R4.2 SG_2.2
GND: C1.1 C2.1 C3.1 C5.2 C6.1 C7.2 C8.2 C9.1 C10.1 C11.1 C12.2 C13.1 C14.1 C15.1 C16.2 C17.2 C18.2 D1.2(-) D2.1(A) H3.2 LED1.3(GND) LED2.2(C) R6.1 R11.1 R12.1 SW2.1 U2.6(GND) U2.7(RES) U2.8(GND) U3.5(AGND) U3.9(INNB) U3.10(INPB) U4.3(GND) U4.6(GND) U5.3(GND) U5.29(EP) U6.1(GND) U6.15(GND) U6.38(GND) U6.39(GND) U7.1(ADJ(GND)) USBC1.0 USBC1.A1(GND) USBC1.A12(GND) USBC1.B1(GND) USBC1.B12(GND)
BATT_POS: C7.1 D1.1(+) U4.1(VIN)
BLINK_GREEN: R19.2 U6.27(IO16)
BLINK_RED: R21.1 U6.26(IO4)
CP_DTR: Q6.2(E) R7.1 U5.28(DTR)
CP_RTS: Q5.2(E) R8.1 U5.24(RTS)
ESP_EN: C12.1 R9.2 R14.1 SW2.2 U6.3(EN)
ESP_IO0: R10.2 R13.1 U6.25(IO0)
ESP_RXD: U5.26(TXD) U6.34(RXD0)
ESP_TXD: U5.25(RXD) U6.35(TXD0)
GYR_INT1: U2.12(INT1) U6.12(IO27)
GYR_INT2: U2.11(INT2) U6.28(IO17)
LED_DATA: R15.2 U6.14(IO12)
S_A1: R3.2 R4.1 U3.8(INPA)
S_A2: SG_1.2 SG_2.1 U3.7(INNA)
S_AVDD: C4.2 Q1.3(C) R2.2 R3.1 SG_1.1 U3.3(AVDD)
S_BASE: Q1.1(B) U3.2(BASE)
S_DOUT: U3.12(DOUT) U6.31(IO19)
S_PD_SCK: U3.11(PD_SCK) U6.30(IO18)
S_VFB: R1.2 R2.1 U3.4(VFB)
SCL_1: U2.1(SCL/SPC) U6.10(IO25)
SDA_1: U2.4(SDA/SDI/SDO) U6.11(IO26)
USB_CC1: R12.2 USBC1.A5(CC1)
USB_CC2: R11.2 USBC1.B5(CC2)
USB_D+: U5.4(D+) USBC1.A6(DP1) USBC1.B6(DP2)
USB_D-: U5.5(D-) USBC1.A7(DN1) USBC1.B7(DN2)
V_BUS: C10.2 C11.2 C16.1 U5.7(REGIN) U5.8(VBUS) U7.3(VIN) USBC1.A4(VBUS) USBC1.A9(VBUS) USBC1.B4(VBUS) USBC1.B9(VBUS)
$1N315: D1.4(C1) SW1.2
$1N361: BAT1.2 D1.3(C2)
$1N365: BAT1.1 SW1.3
$1N666: D2.2(K) L1.1 U4.2(OUTPUT)
$1N1107: R5.1 U4.4(FB)
$1N1165: R6.2 U4.5(ON#/OFF)
$1N3382: LED1.4(DIN) R15.1
$1N3717: LED2.1(A) R18.1
$1N4432: LED3.3(-) R19.1
$1N4504: LED3.2(-) R21.2
$2N1710: C6.2 U3.6(VBG)
$2N2425: STRAIN_1.1 STRAIN_1.2
$2N2441: STRAIN_2.1 STRAIN_2.2
$2N3141: H1.3 R16.3
$2N3145: H1.1 R16.1
$2N3149: H1.2 R16.2
$2N3226: H2.3 R17.3
$2N3229: H2.1 R17.1
$2N3232: H2.2 R17.2
$2N3295: STRAIN_IN1.1 STRAIN_IN1.2
$2N3339: STRAIN_IN2.1 STRAIN_IN2.2
$3N1098: Q5.3(C) R9.1
$3N1099: Q6.3(C) R10.1
$3N1100: Q6.1(B) R8.2
$3N1101: Q5.1(B) R7.2
$3N1118: C9.2 U5.6(VDD)

Not connected (* = marked no-connect by the designer): LED1 2(DOU); LED3 4(-)*; SW1 1 4 5; SW2 3 4; U2 2(CS) 3(SDO/SA0) 5(NC); U3 13(XO)* 14(XI)*; U5 1(DCD) 2(RI) 9(RST#) 10(NC) 11(SUSPEND#) 12(SUSPEND) 13(NC) 14(NC) 15(NC) 16(NC) 17(NC) 18(NC) 19(NC) 20(NC) 21(NC) 22(NC) 23(CTS) 27(DSR); U6 4(SENSOR_VP) 5(SENSOR_VN) 6(IO34) 7(IO35) 8(IO32) 9(IO33) 13(IO14) 16(IO13) 17(NC) 18(NC) 19(NC) 20(NC) 21(NC) 22(NC) 23(IO15) 24(IO2) 29(IO5) 32(NC) 33(IO21) 36(IO22) 37(IO23); USBC1 A8(SBU1) B8(SBU2)

## Notes on the sheets
sheet 1
- Strain Gauge
- 9v battery input
- Gyroscope
- ESP32 and Connections
- Reset SW
- Buck Converter (12v Max)
- ESP Decoupler Caps
- Blinky Fun
- Test Point and
  Status LED
sheet 2
- Make Similar Sized Resistors
- Better Optimize Capacitors
- Gyroscope Sensor
- Voltage divider to set
  analog reference voltage
- Wheatstone bridge
- Loadcell Amplifier
- On PCB Trim Pots
  Because James is Paranoid
- V0.2
  - Connected Loadcell AMP to Ground (was floating AGND not connected to GND)
sheet 3
- Magical Reset ESP
  when USB programming
- LDO for 3V3 from
  USB when programming
- USB C Connector
- CP2102 USB <--> Serial
- CP2102 Decoupling
